# EasyEDA Pro project XRAY.epro, board PCB6
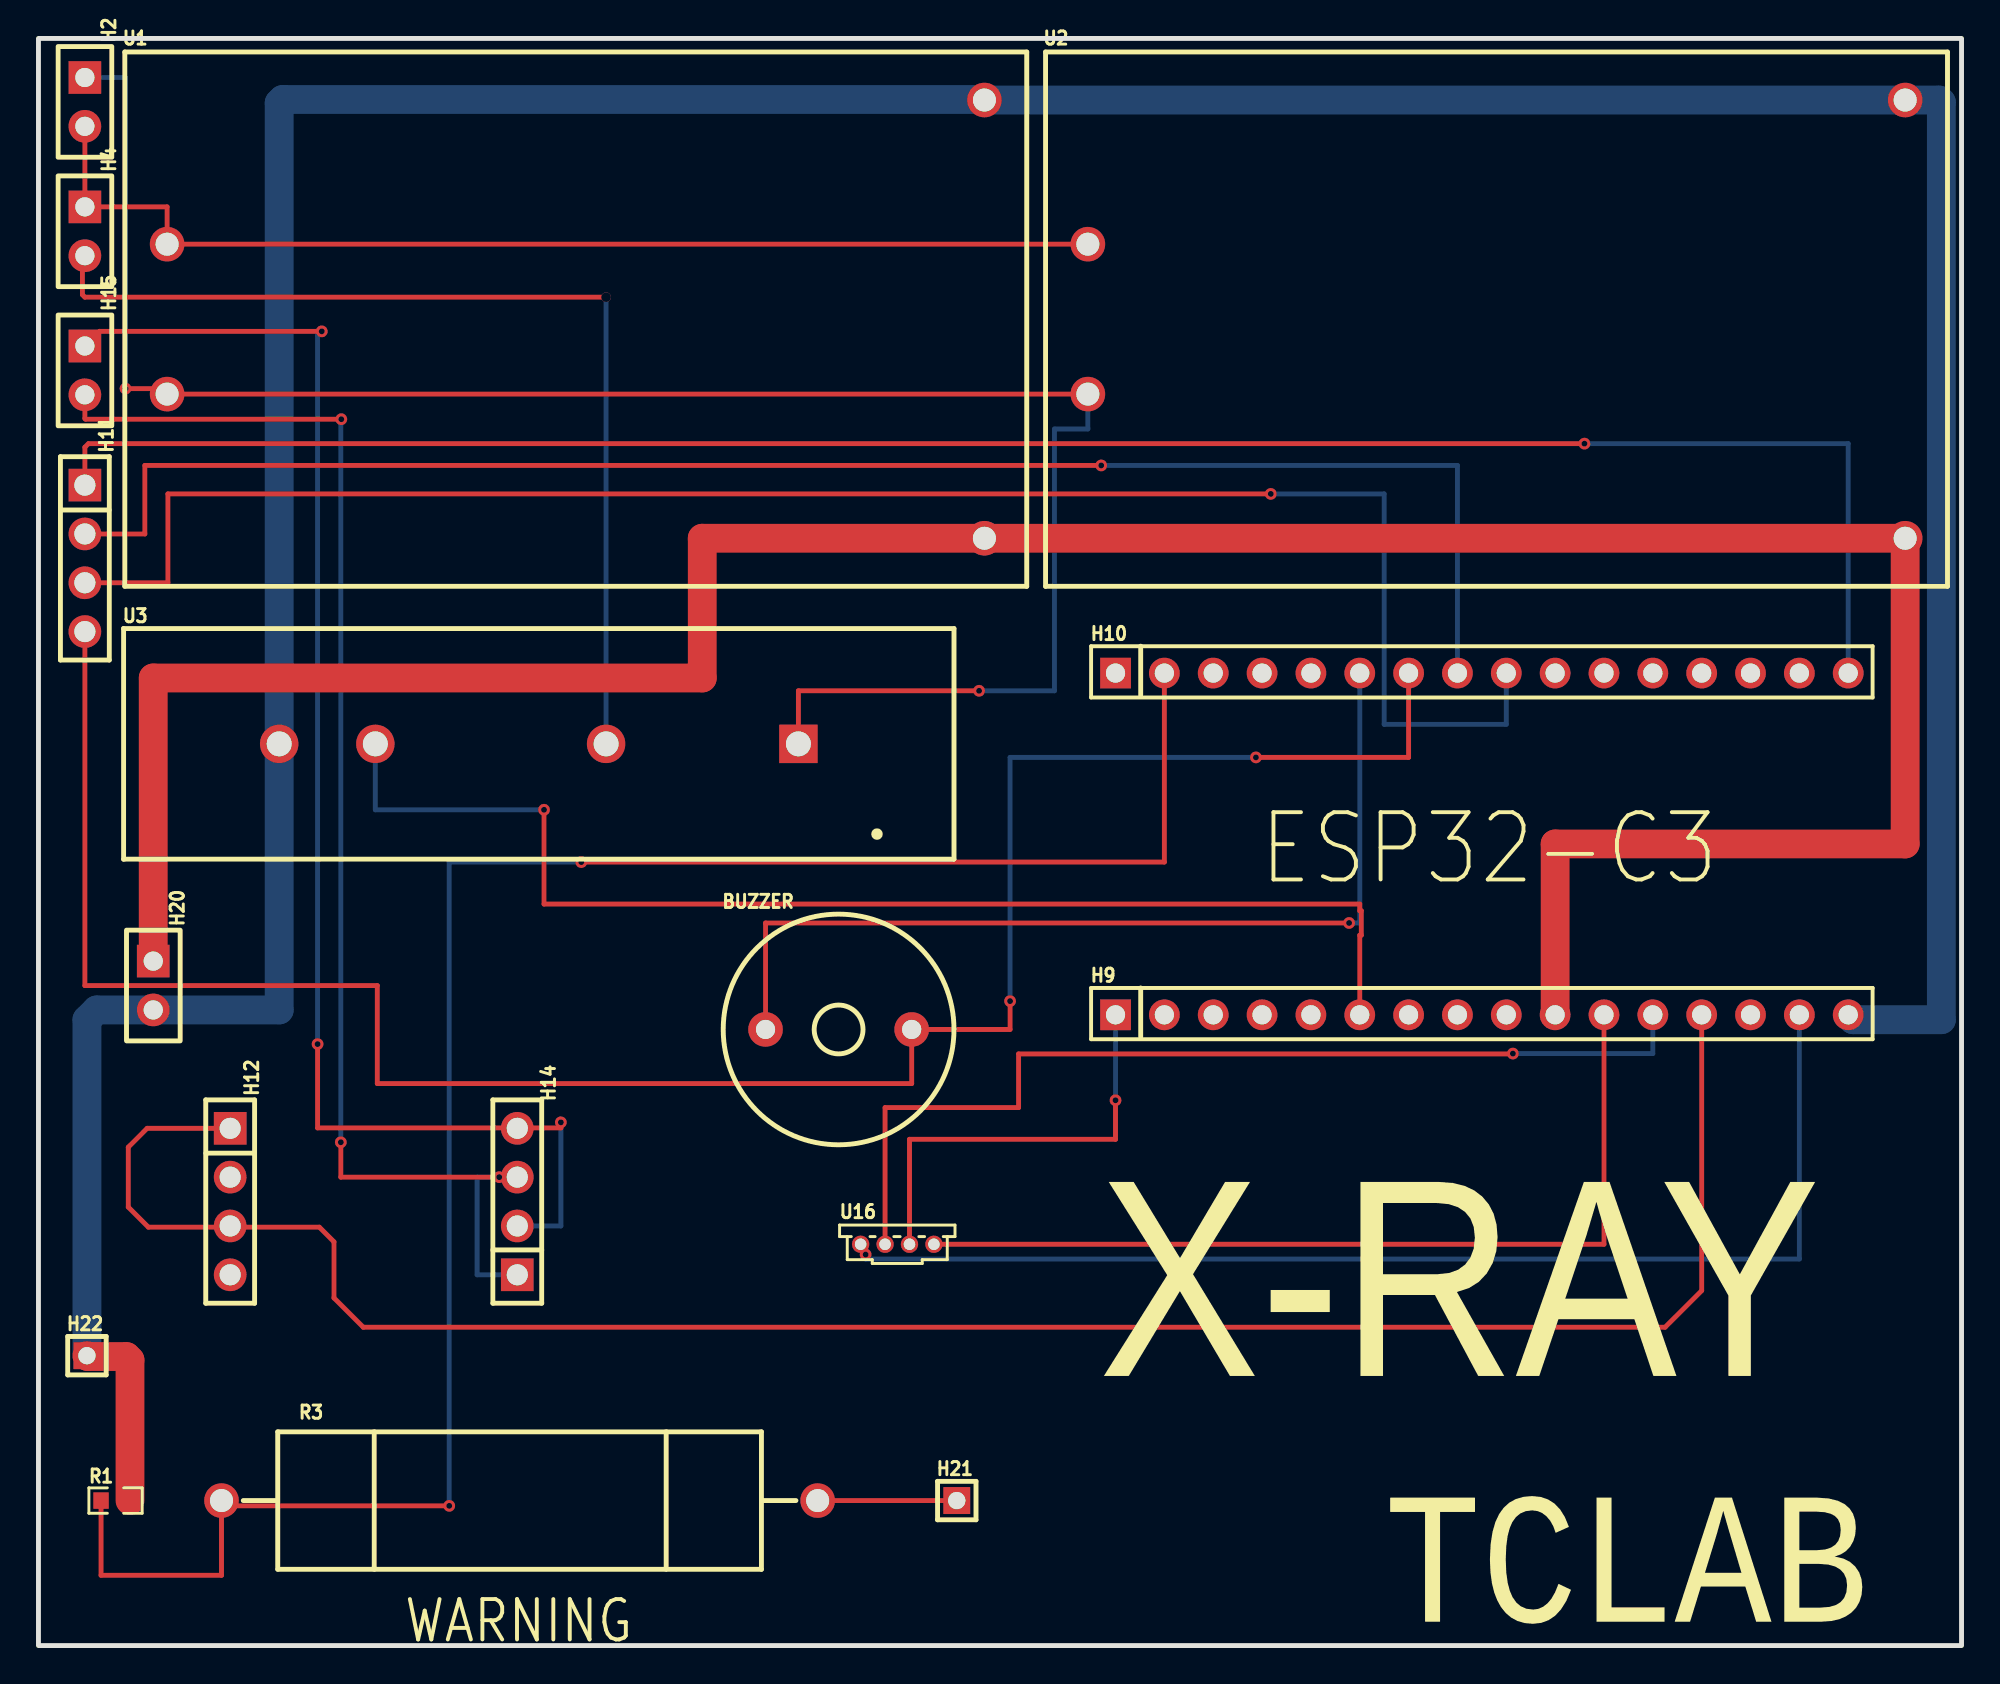
[diagram p3: board, top side]
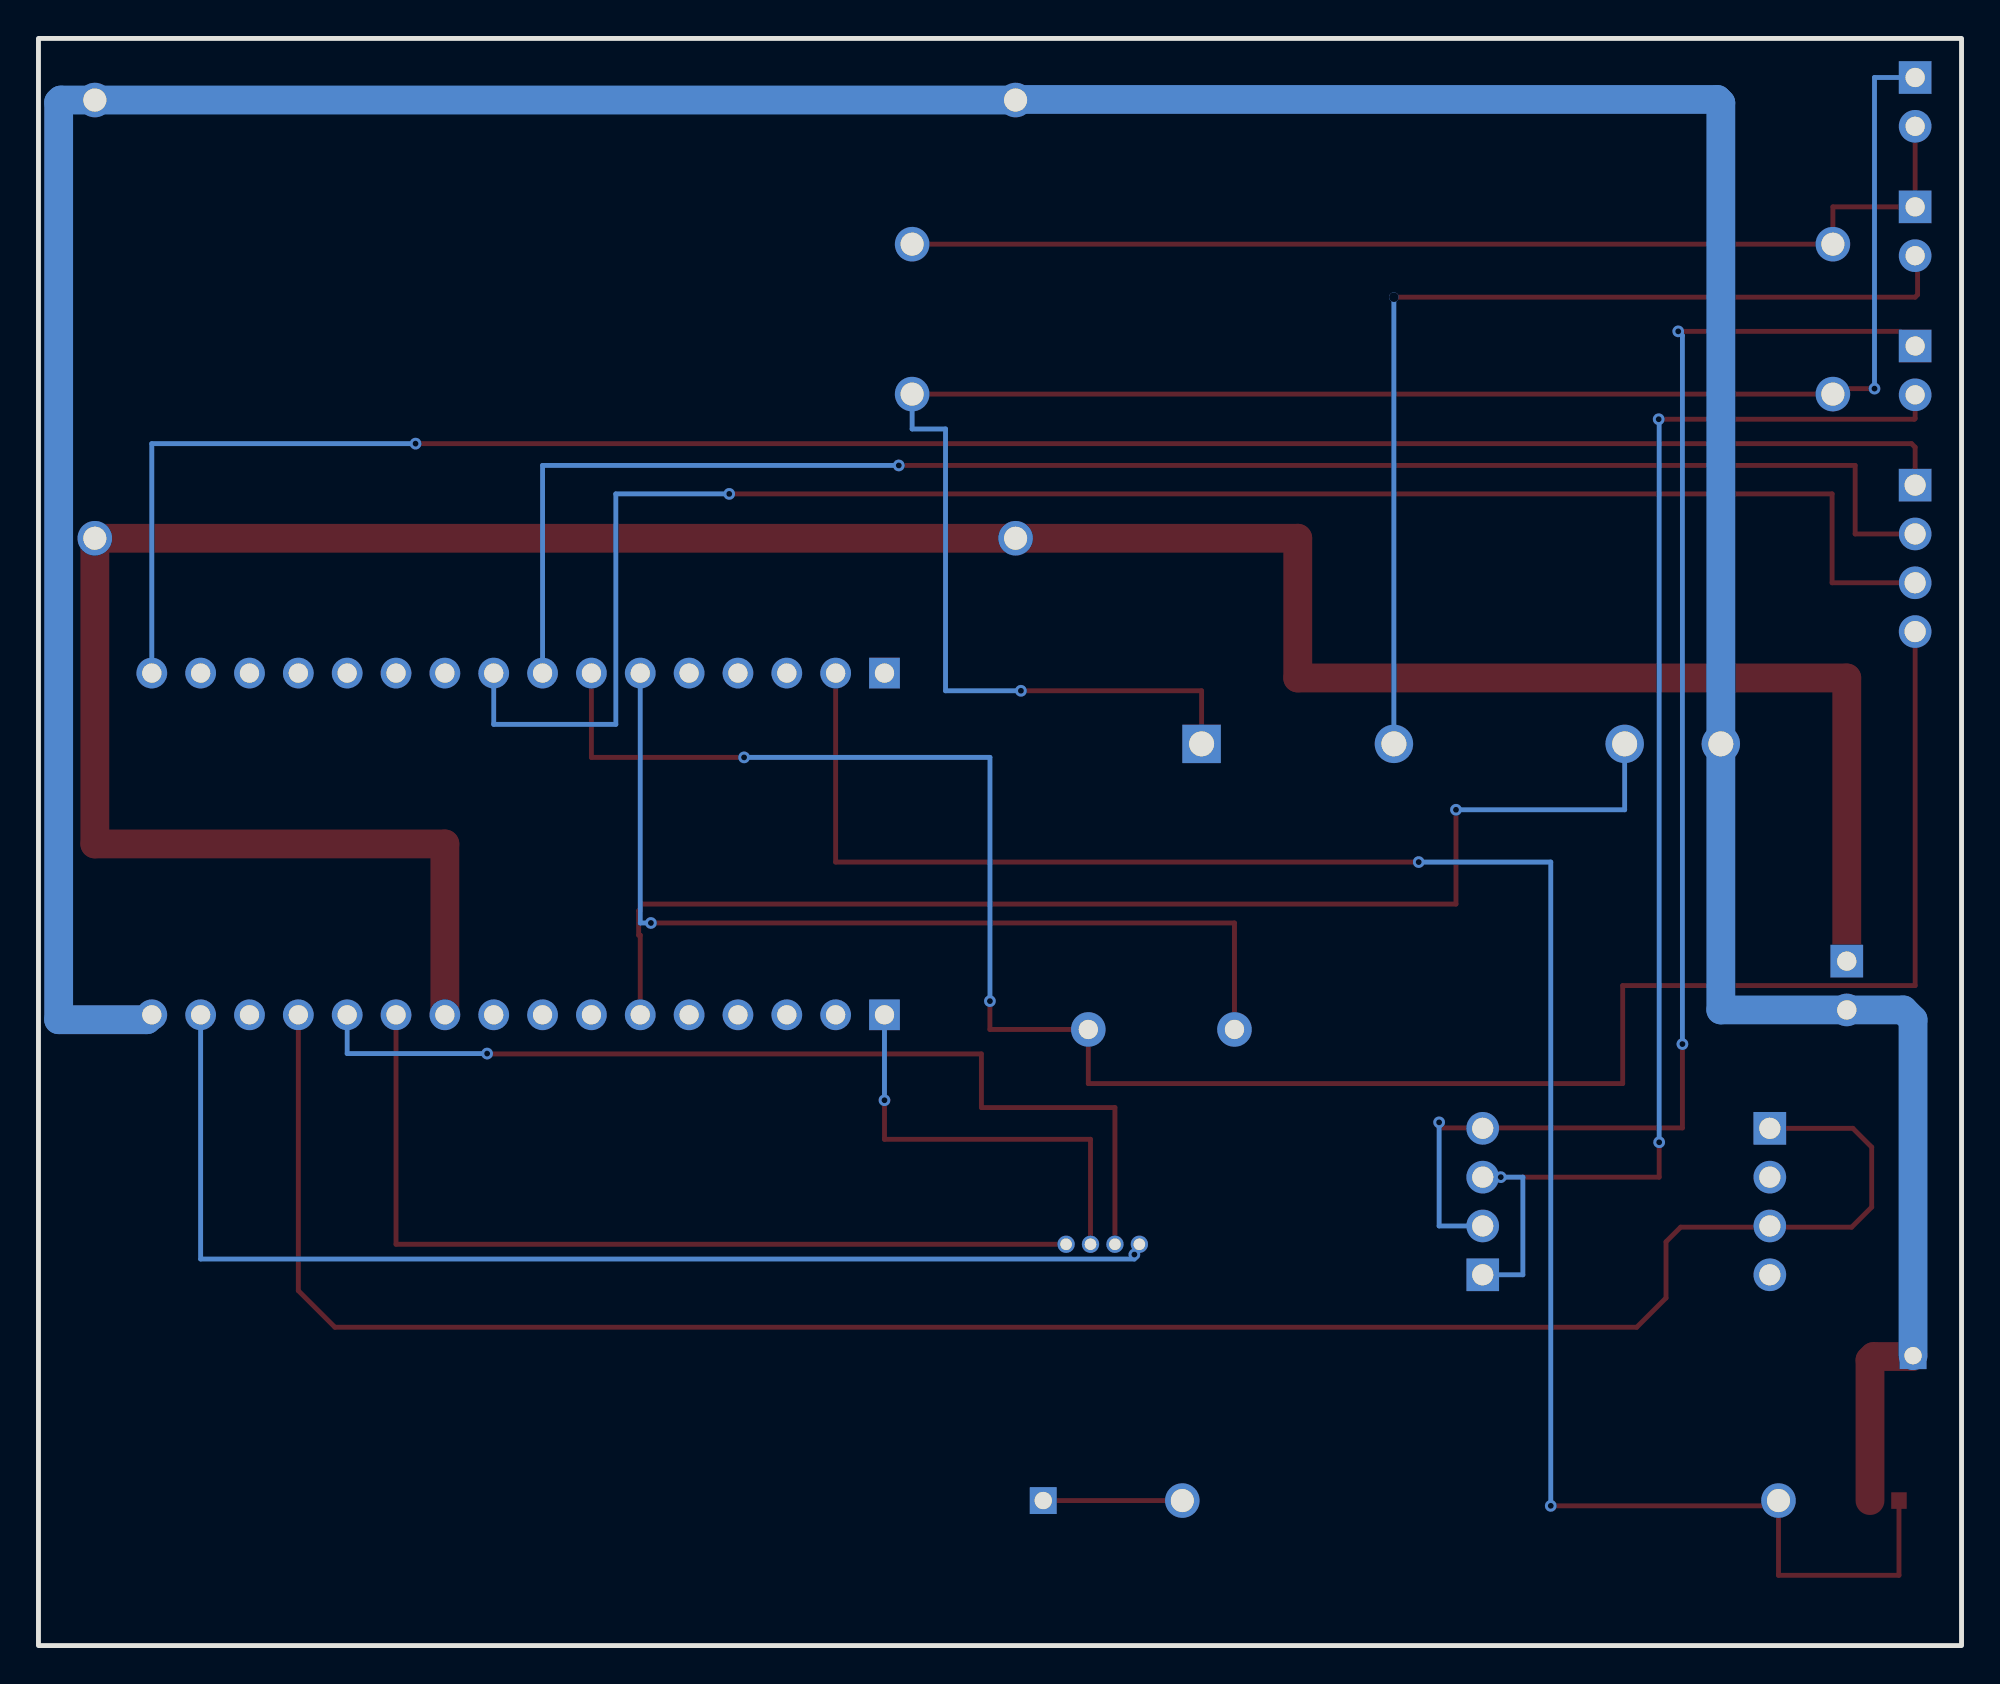
[diagram p4: board, bottom side, seen from below]

Outline 100 x 83.62 mm; copper layers: Top Layer, Bottom Layer. Coordinates in mm from the lower left corner of the outline.
Outline path: rectangle 0,83.62 100,0
Stack: Top Layer 0.035mm / Dielectric1 1.51mm FR4 er 4.5 / Bottom Layer 0.035mm

## Design rules (mm)
template: 自定义配置
spacing copperThickness1oz (default): track to track 0.102, other pairs 0.152 to 0.3
spacing copperThickness2oz: track to track 0.203, other pairs 0.152 to 0.3
track width copperThickness1oz (default): min 0.127, default 0.254, max 2.54
track width copperThickness2oz: min 0.203, default 0.254, max 2.54
track width bold: min 1.2, default 1.5, max 1.5
differential pair differentialPair (default): width min 0.127, default 0.254, max 2.54; gap min 0.152, default 0.152
via viaSize (default): diameter min 0.5, default 0.61, max 10; hole min 0.3, default 0.305, max 6.3
net 3.3V uses bold
net GND uses bold

## Placement (name value [footprint] x y rotation side)
BUZZER  2300Hz  [BUZ-TH_BD12.0-P7.60-D0.6-FD]  41.61 32.05 0 top
H2  -  [HDR-TH_2P-P2.54-V-F]  2.41 80.31 270 top
H4  -  [HDR-TH_2P-P2.54-V-F]  2.41 73.58 270 top
H9  ESP32C3-R  [HDR-TH_16P-P2.54-V-F]  75.06 32.82 0 top
H10  ESP2C3-L  [HDR-TH_16P-P2.54-V-F]  75.06 50.6 0 top
H11  串口  [HDR-TH_4P-P2.54-V-F]  2.41 56.57 270 top
H12  -  [HDR-TH_4P-P2.54-V-F]  9.97 23.1 270 top
H14  -  [HDR-TH_4P-P2.54-V-F]  24.9 23.1 90 top
H15  灯丝输出  [HDR-TH_2P-P2.54-V-F]  2.41 66.34 270 top
H20  灯丝驱动电源  [HDR-TH_2P-P2.54-V-F]  5.97 34.34 270 top
H21  120KV+  [HDR-TH_1P-V-M_XKB_X4611WV-01I-C28D40]  47.75 7.54 0 top
H22  120KV-  [HDR-TH_1P-V-M_XKB_X4611WV-01I-C28D40]  2.52 15.08 0 top
R1  120K  [R0603]  4.01 7.54 0 top
R3  20G  [RES-TH_BD7.0-L25.0-P31.00-D1.0]  25.02 7.54 0 top
U1  HLK-10M03  [PWRM-TH_HLK-10M05]  27.94 69.01 0 top
U2  HLK-10M03  [PWRM-TH_HLK-10M05]  75.82 69.01 0 top
U3  PMN5D6132  [DIP-4_L43.2-W12.0-PMN5A2032]  26.02 46.91 0 top
U16  AHT25  [SENSOR-TH_AHT25]  44.66 20.88 0 top

## Footprints (pads in the part's own frame, mm; a bottom-side part is the same pattern mirrored in y, then rotated)
BUZ-TH_BD12.0-P7.60-D0.6-FD
  round 1.8 hole 1: 1(-3.8,0) 2(3.8,0)
DIP-4_L43.2-W12.0-PMN5A2032
  rect 2x2 hole 1.3: 1(13.5,0)
  round 2 hole 1.3: 2(3.5,0) 3(-8.5,0) 4(-13.5,0)
HDR-TH_1P-V-M_XKB_X4611WV-01I-C28D40
  rect 1.4x1.4 hole 0.9: 1(0,0)
HDR-TH_2P-P2.54-V-F
  rect 1.7x1.7 hole 1: 1(-1.27,0)
  round 1.7 hole 1: 2(1.27,0)
HDR-TH_4P-P2.54-V-F
  rect 1.7x1.7 hole 1.1: 1(-3.81,0)
  round 1.7 hole 1.1: 2(-1.27,0) 3(1.27,0) 4(3.81,0)
HDR-TH_16P-P2.54-V-F
  rect 1.6x1.6 hole 1: 1(-19.05,0)
  round 1.6 hole 1: 2(-16.51,0) 3(-13.97,0) 4(-11.43,0) 5(-8.89,0) 6(-6.35,0) 7(-3.81,0) 8(-1.27,0) 9(1.27,0) 10(3.81,0) 11(6.35,0) 12(8.89,0) 13(11.43,0) 14(13.97,0) 15(16.51,0) 16(19.05,0)
PWRM-TH_HLK-10M05
  round 1.8 hole 1.2: 1(-21.25,3.9) 2(-21.25,-3.9) 3(21.25,11.4) 4(21.25,-11.4)
R0603
  rect 0.806x0.864 smd: 1(-0.753,0) 2(0.753,0)
RES-TH_BD7.0-L25.0-P31.00-D1.0
  round 1.8 hole 1.2: 1(-15.5,0) 2(15.5,0)
SENSOR-TH_AHT25
  round 0.9 hole 0.6: 1(-1.905,0) 2(-0.635,0) 3(0.635,0) 4(1.905,0)

## Nets
As in the schematic.

Pads without a net: H9 2 3 4 5 7 8 9 14; H10 1 3 4 5 10 11 12 13 14 15; H12 2 4

## Via types
v1: diameter 0.61, hole 0.305, Top Layer to Bottom Layer, 20 vias
v2: diameter 0.5, hole 0.61, Top Layer to Bottom Layer, 1 via

## Routing (per net, layer and track width the routed paths; a pad name or vN(x,y) marks a point on that pad's centre or on a via; arc(x,y) is an arc through that point)
3.3V: length 156.1
  Top Layer w1.5: H9.10 78.87,41.71 97.07,41.71 97.07,57.61 34.52,57.61 34.52,50.34 5.97,50.34 H20.1
3.3V-SW: length 110.2
  Top Layer w0.254: H9.13 86.49,18.47 84.58,16.56 16.89,16.56 15.37,18.08 15.37,21.01 14.6,21.77 10.03,21.77 H12.3 9.97,21.77 5.71,21.77 4.67,22.81 4.67,25.93 5.65,26.91 H12.1
220V-SW: length 65.5
  Top Layer w0.254: H9.6 68.71,36.96 68.79,36.96 68.79,38.23 68.71,38.23 68.71,38.58 26.29,38.58 v1(26.29,43.48)
  Bottom Layer w0.254: U3.3 17.52,43.48 v1(26.29,43.48)
GND: length 223.8
  Top Layer w1.5: H22.1 2.57,15.04 4.57,15.04 4.76,14.85 4.76,7.54
  Bottom Layer w1.5: H22.1 2.52,32.56 3.03,33.07 H20.2 12.52,33.07 U3.4 12.52,80.26 12.7,80.44 49.16,80.44 49.19,80.41 98.84,80.41 98.95,80.3 98.95,32.56 94.36,32.56 H9.16
120KV-DET: length 106.4
  Top Layer w0.254: v1(28.23,40.76) 58.55,40.76 H10.2 ; 9.52,7.27 9.52,3.66 3.25,3.66 R1.1 ; 9.52,7.27 v1(21.36,7.27) ; 9.52,7.27 R3.1
  Bottom Layer w0.254: v1(28.23,40.76) 21.36,40.76 v1(21.36,7.27)
$1N1416: length 52.6
  Top Layer w0.254: H4.2 2.29,72.19 2.29,70.28 2.41,70.15 v2(29.52,70.15)
  Bottom Layer w0.254: U3.2 v2(29.52,70.15)
$1N4648: length 105.7
  Top Layer w0.254: v1(80.39,62.53) 2.6,62.53 2.41,62.35 H11.1
  Bottom Layer w0.254: H10.16 94.11,62.53 v1(80.39,62.53)
$1N4656: length 85.7
  Top Layer w0.254: v1(55.26,61.4) 5.53,61.4 5.53,57.84 H11.2
  Bottom Layer w0.254: v1(55.26,61.4) 73.79,61.4 H10.8
$1N4664: length 93.2
  Top Layer w0.254: H11.3 6.73,55.3 6.73,59.92 v1(64.08,59.92)
  Bottom Layer w0.254: v1(64.08,59.92) 69.98,59.92 69.98,47.93 76.33,47.93 H10.9
$1N4672: length 113.7
  Top Layer w0.254: v1(63.31,46.21) 71.25,46.21 H10.7 ; v1(50.52,33.53) 50.52,32.05 BUZZER.2 45.41,29.24 17.62,29.24 17.62,34.34 2.41,34.34 H11.4
  Bottom Layer w0.254: v1(50.52,33.53) 50.52,46.21 v1(63.31,46.21)
$1N5062: length 74.8
  Top Layer w0.254: 24.9,26.93 27.17,26.93 v1(27.17,27.22) ; 24.9,26.93 14.51,26.93 v1(14.51,31.29) ; 24.9,26.93 H14.4 ; v1(14.73,68.38) 3.17,68.38 H15.1
  Bottom Layer w0.254: v1(14.73,68.38) 14.51,68.16 v1(14.51,31.29) ; v1(27.17,27.22) 27.17,21.83 H14.2
$1N5074: length 71.5
  Top Layer w0.254: v1(15.72,26.19) 15.72,24.37 v1(23.96,24.37) H14.3 ; v1(15.75,63.8) 2.45,63.8 2.41,63.84 H15.2
  Bottom Layer w0.254: H14.1 22.81,19.29 22.81,24.37 v1(23.96,24.37) ; v1(15.75,63.8) 15.72,63.78 v1(15.72,26.19)
$1N10162: length 7.2
  Top Layer w0.254: R3.2 H21.1
$1N11280: length 101.9
  Top Layer w0.254: U3.1 39.52,49.68 v1(48.91,49.68) ; 54.57,65.11 6.69,65.11 6.69,65.4 v1(4.53,65.4)
  Bottom Layer w0.254: H2.1 4.53,81.58 v1(4.53,65.4) ; 54.57,65.11 54.57,63.3 52.83,63.3 52.83,49.68 v1(48.91,49.68)
$1N11281: length 58.3
  Top Layer w0.254: H2.2 H4.1 6.69,74.85 U1.1 U2.1
$1N12469: length 62.3
  Top Layer w0.254: v1(43.01,20.34) 43.01,20.88 U16.1
  Bottom Layer w0.254: v1(43.01,20.34) 43.01,20.11 91.57,20.11 H9.15
$1N12482: length 51.9
  Top Layer w0.254: v1(76.67,30.8) 76.65,30.78 50.97,30.78 50.97,27.99 44.02,27.99 U16.2
  Bottom Layer w0.254: v1(76.67,30.8) 83.95,30.8 H9.12
$1N12487: length 46.8
  Top Layer w0.254: H9.11 81.41,20.88 U16.4
$1N12492: length 22.7
  Top Layer w0.254: U16.3 45.29,26.34 56.01,26.34 v1(56.01,28.37)
  Bottom Layer w0.254: v1(56.01,28.37) H9.1
$1N12533: length 49.4
  Top Layer w0.254: v1(68.15,37.6) 37.81,37.6 BUZZER.1
  Bottom Layer w0.254: v1(68.15,37.6) 68.71,37.6 H10.6

## Text on the board
Top Silkscreen Layer: WARNING | ESP32-C3 | TCLAB | X-RAY
